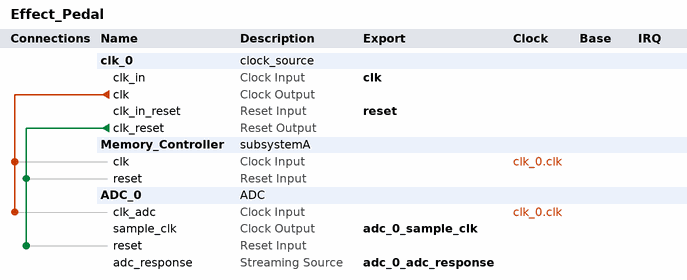
[diagram p0: system contents]
# Platform Designer (Qsys) system Effect_Pedal, MAX 10 10M50DAF484C7G
# Parameters at their usual value, and those the tool derives, are not listed.
package require -exact qsys 20.1
create_system Effect_Pedal
set_project_property DEVICE_FAMILY {MAX 10}
set_project_property DEVICE 10M50DAF484C7G

add_instance clk_0 clock_source 20.1
set_instance_parameter_value clk_0 clockFrequency 50000000

add_instance Memory_Controller subsystemA 1.0

add_instance ADC_0 ADC 1.0

# connections
add_connection clk_0.clk ADC_0.clk_adc clock
add_connection clk_0.clk Memory_Controller.clk clock
add_connection clk_0.clk_reset ADC_0.reset reset
add_connection clk_0.clk_reset Memory_Controller.reset reset

# exported interfaces
add_interface adc_0_adc_response avalon_streaming source
set_interface_property adc_0_adc_response EXPORT_OF ADC_0.adc_response
add_interface adc_0_sample_clk clock source
set_interface_property adc_0_sample_clk EXPORT_OF ADC_0.sample_clk
add_interface clk clock sink
set_interface_property clk EXPORT_OF clk_0.clk_in
add_interface reset reset sink
set_interface_property reset EXPORT_OF clk_0.clk_in_reset

set_interconnect_requirement {$system} qsys_mm.clockCrossingAdapter HANDSHAKE
set_interconnect_requirement {$system} qsys_mm.enableEccProtection FALSE
set_interconnect_requirement {$system} qsys_mm.insertDefaultSlave FALSE
set_interconnect_requirement {$system} qsys_mm.maxAdditionalLatency 1

save_system Effect_Pedal.qsys
